# Altium schematic sheet Spartan6-Power.SchDoc
size A
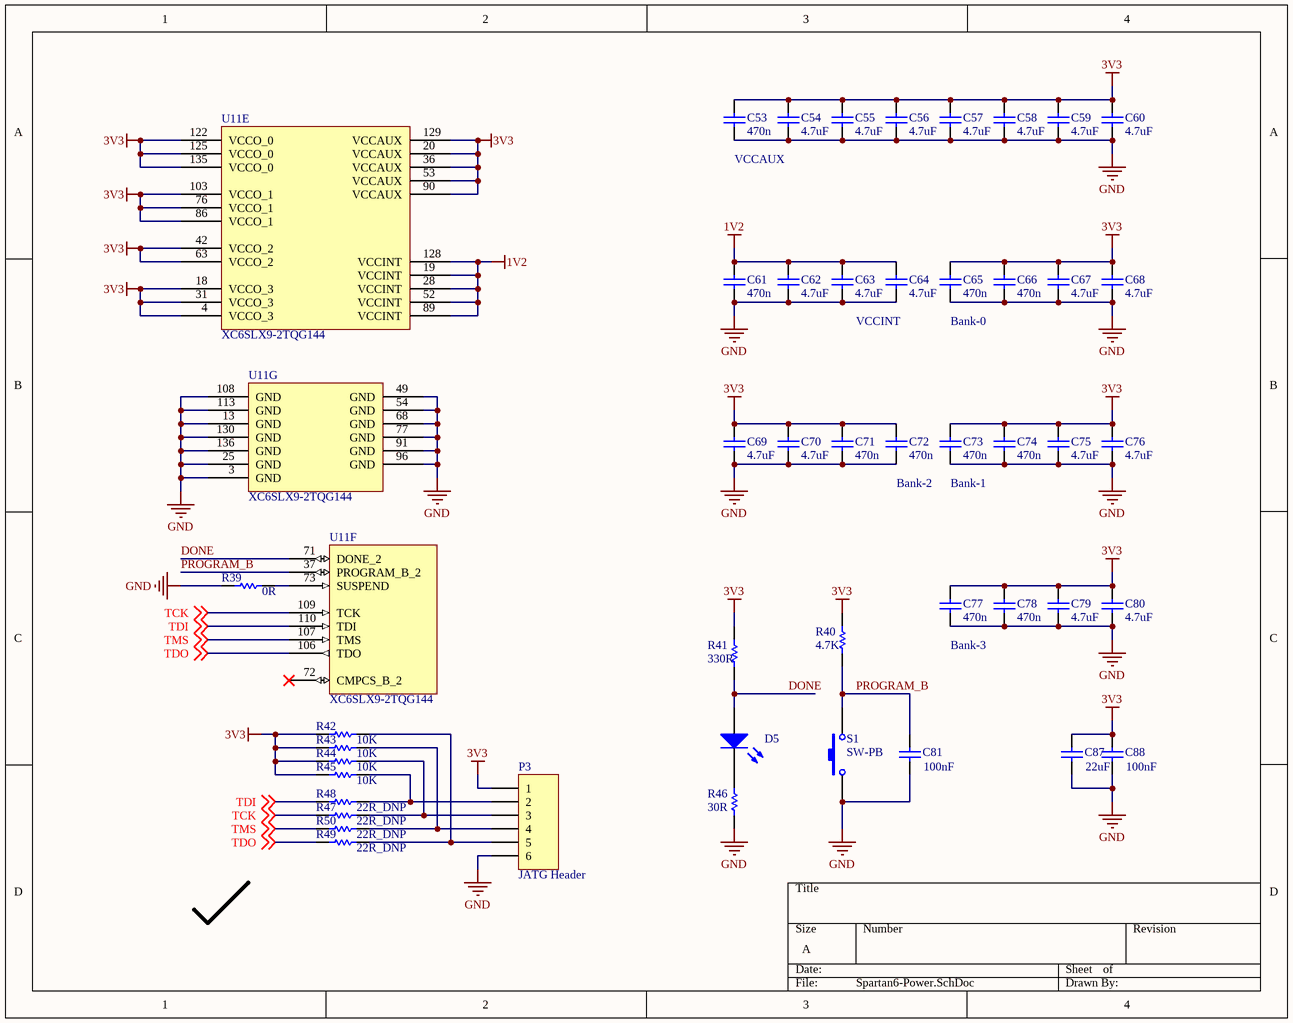
[diagram p0: Spartan6-Power.SchDoc]

## Parts
C53  value 470n  [0402]  (hidden comment: Cap Semi)
C54  value 4.7uF  [0603PKG]  (hidden comment: Cap Semi)
C55  value 4.7uF  [0603PKG]  (hidden comment: Cap Semi)
C56  value 4.7uF  [0603PKG]  (hidden comment: Cap Semi)
C57  value 4.7uF  [0603PKG]  (hidden comment: Cap Semi)
C58  value 4.7uF  [0603PKG]  (hidden comment: Cap Semi)
C59  value 4.7uF  [0603PKG]  (hidden comment: Cap Semi)
C60  value 4.7uF  [0603PKG]  (hidden comment: Cap Semi)
C61  value 470n  [0402]  (hidden comment: Cap Semi)
C62  value 4.7uF  [0603PKG]  (hidden comment: Cap Semi)
C63  value 4.7uF  [0603PKG]  (hidden comment: Cap Semi)
C64  value 4.7uF  [0603PKG]  (hidden comment: Cap Semi)
C65  value 470n  [0402]  (hidden comment: Cap Semi)
C66  value 470n  [0402]  (hidden comment: Cap Semi)
C67  value 4.7uF  [0603PKG]  (hidden comment: Cap Semi)
C68  value 4.7uF  [0603PKG]  (hidden comment: Cap Semi)
C69  value 4.7uF  [0603PKG]  (hidden comment: Cap Semi)
C70  value 4.7uF  [0603PKG]  (hidden comment: Cap Semi)
C71  value 470n  [0402]  (hidden comment: Cap Semi)
C72  value 470n  [0402]  (hidden comment: Cap Semi)
C73  value 470n  [0402]  (hidden comment: Cap Semi)
C74  value 470n  [0402]  (hidden comment: Cap Semi)
C75  value 4.7uF  [0603PKG]  (hidden comment: Cap Semi)
C76  value 4.7uF  [0603PKG]  (hidden comment: Cap Semi)
C77  value 470n  [0402]  (hidden comment: Cap Semi)
C78  value 470n  [0402]  (hidden comment: Cap Semi)
C79  value 4.7uF  [0603PKG]  (hidden comment: Cap Semi)
C80  value 4.7uF  [0603PKG]  (hidden comment: Cap Semi)
C81  value 100nF  [C0805]  (hidden comment: Cap)
C87  value 22uF  [C1206]  (hidden comment: Cap)
C88  value 100nF  [C0805]  (hidden comment: Cap)
D5  LED0  [C0805]  (value not drawn)
P3  JATG Header  [HDR1X6]
R39  value 0R  [0603PKG]  (hidden comment: Res1)
R40  value 4.7K  [0603PKG]  (hidden comment: Res1)
R41  value 330R  [0603PKG]  (hidden comment: Res1)
R42  value 10K  [0603PKG]  (hidden comment: Res Semi)
R43  value 10K  [0603PKG]  (hidden comment: Res Semi)
R44  value 10K  [0603PKG]  (hidden comment: Res Semi)
R45  value 10K  [0603PKG]  (hidden comment: Res Semi)
R46  value 30R  [0603PKG]  (hidden comment: Res1)
R47  value 22R_DNP  [0603PKG]  (hidden comment: Res Semi)
R48  value 22R_DNP  [0603PKG]  (hidden comment: Res Semi)
R49  value 22R_DNP  [0603PKG]  (hidden comment: Res Semi)
R50  value 22R_DNP  [0603PKG]  (hidden comment: Res Semi)
S1  SW-PB  [SMD push button]
U11  XC6SLX9-2TQG144  [TQG144]  (parts E,F,G of 7)

## Nets
1V2: C61.1 C62.1 C63.1 C64.1 U11.19(VCCINT) U11.28(VCCINT) U11.52(VCCINT) U11.89(VCCINT) U11.128(VCCINT)
3V3: C53.1 C54.1 C55.1 C56.1 C57.1 C58.1 C59.1 C60.1 C65.1 C66.1 C67.1 C68.1 C69.1 C70.1 C71.1 C72.1 C73.1 C74.1 C75.1 C76.1 C77.1 C78.1 C79.1 C80.1 C87.2 C88.2 P3.1 R40.2 R41.2 R42.2 R43.2 R44.2 R45.2 U11.4(VCCO_3) U11.18(VCCO_3) U11.20(VCCAUX) U11.31(VCCO_3) U11.36(VCCAUX) U11.42(VCCO_2) U11.53(VCCAUX) U11.63(VCCO_2) U11.76(VCCO_1) U11.86(VCCO_1) U11.90(VCCAUX) U11.103(VCCO_1) U11.122(VCCO_0) U11.125(VCCO_0) U11.129(VCCAUX) U11.135(VCCO_0)
GND: C53.2 C54.2 C55.2 C56.2 C57.2 C58.2 C59.2 C60.2 C61.2 C62.2 C63.2 C64.2 C65.2 C66.2 C67.2 C68.2 C69.2 C70.2 C71.2 C72.2 C73.2 C74.2 C75.2 C76.2 C77.2 C78.2 C79.2 C80.2 C81.1 C87.1 C88.1 P3.6 R39.1 R46.1 S1.1 U11.3(GND) U11.13(GND) U11.25(GND) U11.49(GND) U11.54(GND) U11.68(GND) U11.77(GND) U11.91(GND) U11.96(GND) U11.108(GND) U11.113(GND) U11.130(GND) U11.136(GND)
DONE: D5.1(A) R41.1 U11.71(DONE_2)
PROGRAM_B: C81.2 R40.1 S1.2 U11.37(PROGRAM_B_2)
TCK: R47.2 U11.109(TCK) ; off-sheet TCK
TDI: R48.2 U11.110(TDI) ; off-sheet TDI
TDO: R49.2 U11.106(TDO) ; off-sheet TDO
TMS: R50.2 U11.107(TMS) ; off-sheet TMS
NetD5_2: D5.2(K) R46.2
NetP3_2: P3.2 R45.1 R48.1
NetP3_3: P3.3 R44.1 R47.1
NetP3_4: P3.4 R43.1 R50.1
NetP3_5: P3.5 R42.1 R49.1
NetR39_2: R39.2 U11.73(SUSPEND)

Not connected (* = marked no-connect by the designer): U11 72(CMPCS_B_2)*

## Notes on the sheet
- VCCAUX
- VCCINT
- Bank-0
- Bank-2
- Bank-1
- Bank-3

## Library data of the parts
C53-C80 = Cap Semi: Capacitor (Semiconductor SIM Model); Published: 8-Jun-2000; LatestRevisionDate: 29-May-2009; LatestRevisionNote: IPC-7351 Footprint Added.; PackageReference: C1206; Publisher: Altium Limited; PackageDescription: Chip Capacitor
C81 C87 C88 = Cap: Capacitor; Published: 8-Jun-2000; LatestRevisionDate: 17-Jul-2002; LatestRevisionNote: Re-released for DXP Platform.; PackageReference: RAD-0.3; Publisher: Altium Limited; PackageDescription: Radial Cap, Thru-Hole; 2 Leads; 0.3 in Pin Spacing
D5 = LED0: Typical INFRARED GaAs LED; Published: 8-Jun-2000; LatestRevisionDate: 08-Jul-2005; LatestRevisionNote: Mech Layer 1 removed.; PackageReference: LED-0; Publisher: Altium Limited; PackageDescription: LED; 2 Leads
P3 = Header 6: Header, 6-Pin; LatestRevisionDate: 17-Jul-2002; LatestRevisionNote: Re-released for DXP Platform.; Publisher: Altium Limited
R39-R41 R46 = Res1: Resistor; Published: 8-Jun-2000; LatestRevisionDate: 17-Jul-2002; LatestRevisionNote: Re-released for DXP Platform.; PackageReference: AXIAL-0.3; Publisher: Altium Limited; PackageDescription: Axial Device, Thru-Hole; 2 Leads; 0.3 in Pin Spacing
R42-R45 R47-R50 = Res Semi: Semiconductor Resistor; Published: 8-Jun-2000; LatestRevisionDate: 17-Jul-2002; LatestRevisionNote: Re-released for DXP Platform.; PackageReference: AXIAL-0.5; Publisher: Altium Limited; PackageDescription: Axial Device, Thru-Hole; 2 Leads; 0.5 in Pin Spacing
S1 = SW-PB: Switch; Published: 24-Mar-1999; LatestRevisionDate: 17-Jul-2002; LatestRevisionNote: Re-released for DXP Platform.; PackageReference: SPST-2; Publisher: Altium Limited; PackageDescription: Switch; 2 Leads
U11 = XC6SLX9-2TQG144C: Xilinx Spartan6 LX9